# Altium schematic sheet adapt_board.SchDoc
size A4; SheetNumber: 1; SheetTotal: 1
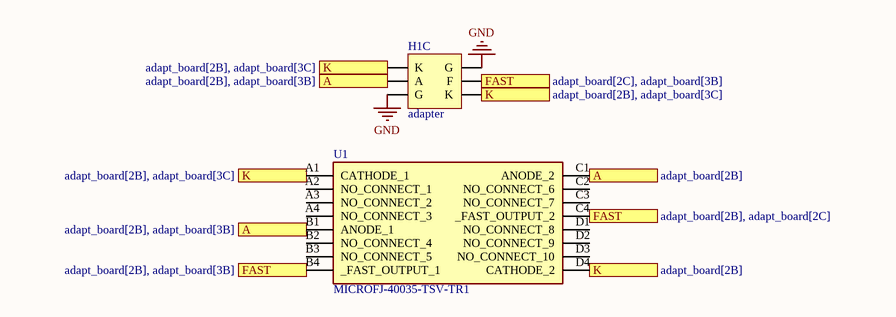
[diagram p0: adapt_board.SchDoc]

## Parts
H1  adapter  [PCBComponent_1]  (part C of 3)
U1  MICROFJ-40035-TSV-TR1  [MICROFJ40035TSVTR1]

## Ports
A (see adapt_board[2B]), A (see adapt_board[2B], adapt_board[3B]), FAST (see adapt_board[2B], adapt_board[2C]), FAST (see adapt_board[2B], adapt_board[3B]), FAST (see adapt_board[2C], adapt_board[3B]), K (see adapt_board[2B]), K (see adapt_board[2B], adapt_board[3C])

## Nets
GND: H1.3(G) H1.6(G)
A: H1.2(A) U1.B1(ANODE_1) U1.C1(ANODE_2) ; port A
FAST: H1.5(F) U1.B4(_FAST_OUTPUT_1) U1.C4(_FAST_OUTPUT_2) ; port FAST
K: H1.1(K) H1.4(K) U1.A1(CATHODE_1) U1.D4(CATHODE_2) ; port K

Not connected (* = marked no-connect by the designer): U1 A2(NO_CONNECT_1) A3(NO_CONNECT_2) A4(NO_CONNECT_3) B2(NO_CONNECT_4) B3(NO_CONNECT_5) C2(NO_CONNECT_6) C3(NO_CONNECT_7) D1(NO_CONNECT_8) D2(NO_CONNECT_9) D3(NO_CONNECT_10)

## Library data of the parts
U1 = MICROFJ-40035-TSV-TR1: Photodiode 420nm 110ps - 14-WBGA; Manufacturer_Name: onsemi; Geometry.Height: 0.67mm; Manufacturer_Part_Number: MICROFJ-40035-TSV-TR1; Mouser Part Number: 863-MFJ40035TSVTR1; Mouser Price/Stock: https://www.mouser.co.uk/ProductDetail/onsemi/MICROFJ-40035-TSV-TR1?qs=byeeYqUIh0Ol5PDp78G1mg%3D%3D; Arrow Part Number: MICROFJ-40035-TSV-TR1; Arrow Price/Stock: https://www.arrow.com/en/products/microfj-40035-tsv-tr1/on-semiconductor?region=nac; Datasheet Link: https://www.onsemi.com/pdf/datasheet/microj-series-d.pdf